# Altium schematic sheet MCU.SchDoc
size A; SheetNumber: 2; SheetTotal: 3
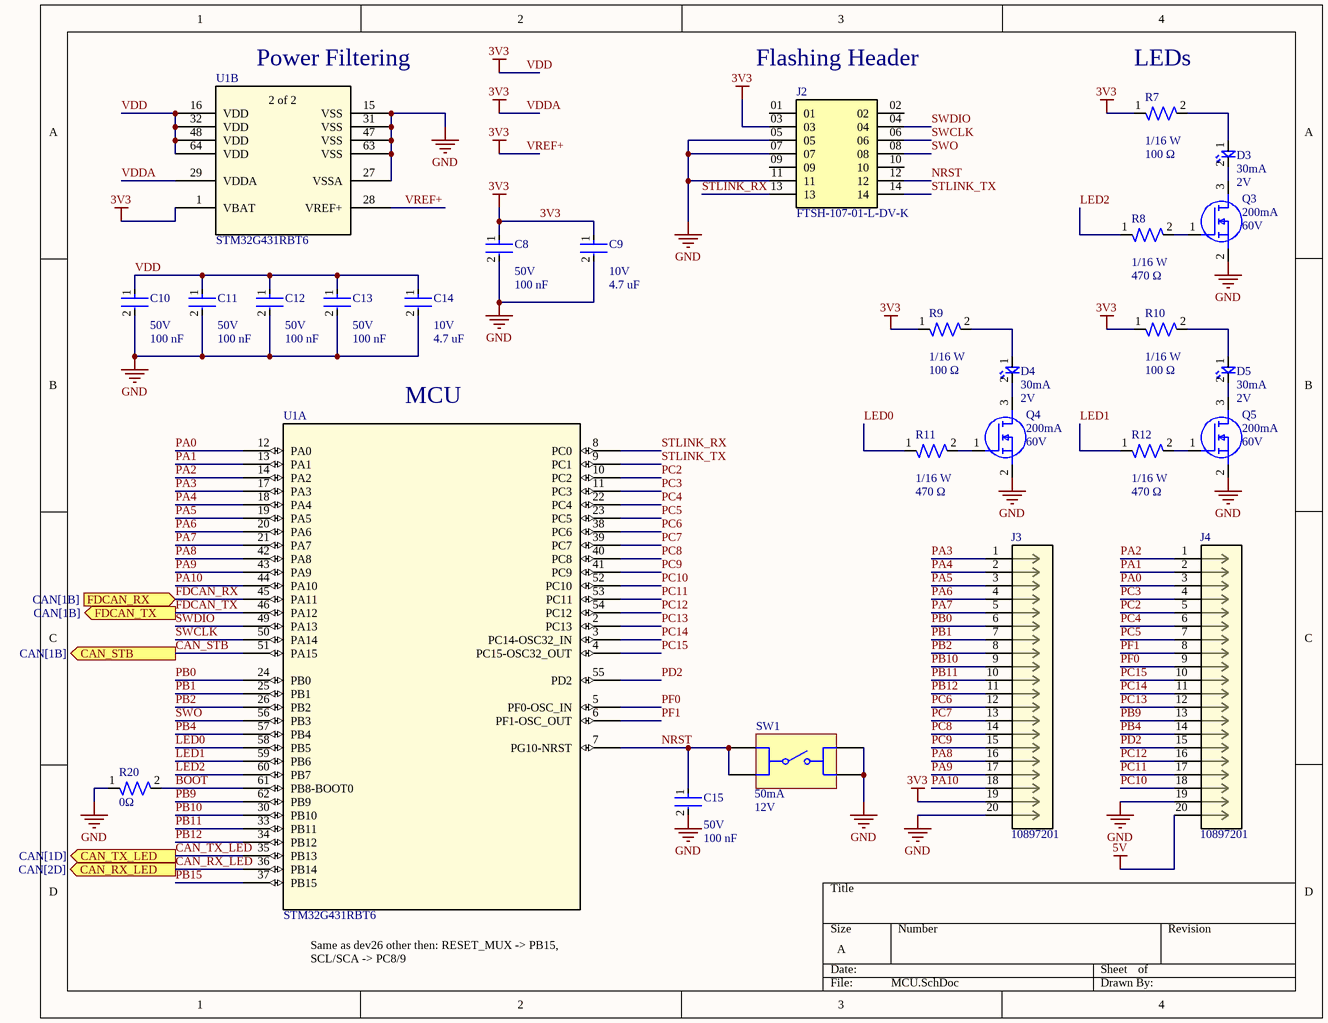
[diagram p0: MCU.SchDoc]

## Parts
C8  Voltage Rating: 50V  Capacitance: 100 nF  [CAP-0603]  (hidden comment: CC0603ZRY5V9BB104)
C9  Voltage Rating: 10V  Capacitance: 4.7 uF  [CAP-0402]  (hidden comment: GRM155R61A475MEAAD)
C10  Voltage Rating: 50V  Capacitance: 100 nF  [CAP-0603]  (hidden comment: CC0603ZRY5V9BB104)
C11  Voltage Rating: 50V  Capacitance: 100 nF  [CAP-0603]  (hidden comment: CC0603ZRY5V9BB104)
C12  Voltage Rating: 50V  Capacitance: 100 nF  [CAP-0603]  (hidden comment: CC0603ZRY5V9BB104)
C13  Voltage Rating: 50V  Capacitance: 100 nF  [CAP-0603]  (hidden comment: CC0603ZRY5V9BB104)
C14  Voltage Rating: 10V  Capacitance: 4.7 uF  [CAP-0402]  (hidden comment: GRM155R61A475MEAAD)
C15  Voltage Rating: 50V  Capacitance: 100 nF  [CAP-0603]  (hidden comment: CC0603ZRY5V9BB104)
D3  Forward Current: 30mA  Forward Voltage: 2V  [LED-0603]  (hidden comment: BL-HKC36G-AV-TRB)
D4  Forward Current: 30mA  Forward Voltage: 2V  [LED-0603]  (hidden comment: BL-HKC36G-AV-TRB)
D5  Forward Current: 30mA  Forward Voltage: 2V  [LED-0603]  (hidden comment: BL-HKC36G-AV-TRB)
J2  FTSH-107-01-L-DV-K  [SAMTEC_FTSH-107-01-L-DV-K]
J3  10897201  [CONN20_0010897201_MOL]
J4  10897201  [CONN20_0010897201_MOL]
Q3  Continuous Current: 200mA  Voltage: 60V  [IC-SOT23-3]  (hidden comment: T2N7002AK,LM)
Q4  Continuous Current: 200mA  Voltage: 60V  [IC-SOT23-3]  (hidden comment: T2N7002AK,LM)
Q5  Continuous Current: 200mA  Voltage: 60V  [IC-SOT23-3]  (hidden comment: T2N7002AK,LM)
R7  Wattage: 1/16 W  Resistance: 100 Ω  [RES-0402]  (hidden comment: RC0402FR-07100RL)
R8  Wattage: 1/16 W  Resistance: 470 Ω  [RES-0402]  (hidden comment: RC0402FR-07470RL)
R9  Wattage: 1/16 W  Resistance: 100 Ω  [RES-0402]  (hidden comment: RC0402FR-07100RL)
R10  Wattage: 1/16 W  Resistance: 100 Ω  [RES-0402]  (hidden comment: RC0402FR-07100RL)
R11  Wattage: 1/16 W  Resistance: 470 Ω  [RES-0402]  (hidden comment: RC0402FR-07470RL)
R12  Wattage: 1/16 W  Resistance: 470 Ω  [RES-0402]  (hidden comment: RC0402FR-07470RL)
R20  Resistance: 0Ω  [RES-2010]  (hidden comment: CRF2010-J/-000ELF)
SW1  Rated Current: 50mA  Rated Voltage (DC): 12V  [430182095816]  (hidden comment: 430182095816)
U1  STM32G431RBT6  [LQFP64-10x10mm]  (parts A,B of 2)

## Ports
CAN_RX_LED (out, see CAN[2D]), CAN_STB (out, see CAN[1B]), CAN_TX_LED (out, see CAN[1D]), FDCAN_RX (in, see CAN[1B]), FDCAN_TX (out, see CAN[1B])

## Nets
3V3: C8.1 C9.1 C10.1 C11.1 C12.1 C13.1 C14.1 J2.03 J3.19 R7.1 R9.1 R10.1 U1.1(VBAT) U1.16(VDD) U1.28(VREF+) U1.29(VDDA) U1.32(VDD) U1.48(VDD) U1.64(VDD)  [also labelled VDD, VDDA, VREF+]
5V: J4.20
GND: C8.2 C9.2 C10.2 C11.2 C12.2 C13.2 C14.2 C15.2 J2.05 J2.07 J2.11 J3.20 J4.19 Q3.2(S) Q4.2(S) Q5.2(S) R20.1 SW1.B1 SW1.B2 U1.15(VSS) U1.27(VSSA) U1.31(VSS) U1.47(VSS) U1.63(VSS)
BOOT: R20.2 U1.61(PB8-BOOT0)
CAN_RX_LED: U1.36(PB14) ; port CAN_RX_LED
CAN_STB: U1.51(PA15) ; port CAN_STB
CAN_TX_LED: U1.35(PB13) ; port CAN_TX_LED
FDCAN_RX: U1.45(PA11) ; port FDCAN_RX
FDCAN_TX: U1.46(PA12) ; port FDCAN_TX
LED0: R11.1 U1.58(PB5)
LED1: R12.1 U1.59(PB6)
LED2: R8.1 U1.60(PB7)
NRST: C15.1 J2.12 SW1.A1 SW1.A2 U1.7(PG10-NRST)
PA0: J4.3 U1.12(PA0)
PA1: J4.2 U1.13(PA1)
PA2: J4.1 U1.14(PA2)
PA3: J3.1 U1.17(PA3)
PA4: J3.2 U1.18(PA4)
PA5: J3.3 U1.19(PA5)
PA6: J3.4 U1.20(PA6)
PA7: J3.5 U1.21(PA7)
PA8: J3.16 U1.42(PA8)
PA9: J3.17 U1.43(PA9)
PA10: J3.18 U1.44(PA10)
PB0: J3.6 U1.24(PB0)
PB1: J3.7 U1.25(PB1)
PB2: J3.8 U1.26(PB2)
PB4: J4.14 U1.57(PB4)
PB9: J4.13 U1.62(PB9)
PB10: J3.9 U1.30(PB10)
PB11: J3.10 U1.33(PB11)
PB12: J3.11 U1.34(PB12)
PB15: U1.37(PB15)
PC2: J4.5 U1.10(PC2)
PC3: J4.4 U1.11(PC3)
PC4: J4.6 U1.22(PC4)
PC5: J4.7 U1.23(PC5)
PC6: J3.12 U1.38(PC6)
PC7: J3.13 U1.39(PC7)
PC8: J3.14 U1.40(PC8)
PC9: J3.15 U1.41(PC9)
PC10: J4.18 U1.52(PC10)
PC11: J4.17 U1.53(PC11)
PC12: J4.16 U1.54(PC12)
PC13: J4.12 U1.2(PC13)
PC14: J4.11 U1.3(PC14-OSC32_IN)
PC15: J4.10 U1.4(PC15-OSC32_OUT)
PD2: J4.15 U1.55(PD2)
PF0: J4.9 U1.5(PF0-OSC_IN)
PF1: J4.8 U1.6(PF1-OSC_OUT)
STLINK_RX: J2.13 U1.8(PC0)
STLINK_TX: J2.14 U1.9(PC1)
SWCLK: J2.06 U1.50(PA14)
SWDIO: J2.04 U1.49(PA13)
SWO: J2.08 U1.56(PB3)
NetD3_1: D3.1 R7.2
NetD3_2: D3.2 Q3.3(D)
NetD4_1: D4.1 R9.2
NetD4_2: D4.2 Q4.3(D)
NetD5_1: D5.1 R10.2
NetD5_2: D5.2 Q5.3(D)
NetQ3_1: Q3.1(G) R8.2
NetQ4_1: Q4.1(G) R11.2
NetQ5_1: Q5.1(G) R12.2

Not connected (* = marked no-connect by the designer): J2 01 02 09 10

## Notes on the sheet
- (near U1) Power Filtering
- (near J2) Flashing Header
- (near R7) LEDs
- (near U1) MCU
- Same as dev26 other then: RESET_MUX -> PB15, SCL/SCA -> PC8/9
- (in symbol IC-STM32G431RBT6, part B) 2 of 2

## Library data of the parts
C8 C10-C13 C15 = CAP 0603
C9 C14 = CAP 0402
D3-D5 = LED-0001: LED YELLOW CLEAR 0603 SMD; ComponentLink1Description: Datasheet; ComponentLink1URL: https://www.americanbrightled.com/pdffiles/led-components/smt/BL-HKC36G-AV-TRB.pdf
J2 = CONN_Flashing-0001: Connector Header Surface Mount 14 position 0.050" (1.27mm); MF: Samtec; Value: *; Price: None; Package: None; Availability: Unavailable; MP: FTSH-107-01-L-DV-K; ComponentLink1Description: Datasheet; ComponentLink1URL: https://mm.digikey.com/Volume0/opasdata/d220001/medias/docus/6209/ftsh-1xx-xx-xxx-dv-xxx-xxx-x-xx-mkt.pdf
J3 J4 = CONN-20: 2.54mm Pitch C-Grid Breakaway Header, Dual Row, Vertical, High Temperature, 20 Circuits, Tin (Sn) Plating, 2.72mm PC Tail Length; Manufacturer_Name: Molex Connector Corporation; Copyright: Copyright (C) 2025 Ultra Librarian. All rights reserved.; Manufacturer_Part_Number: 10897201; Datasheet: https://www.molex.com/en-us/products/part-detail-pdf/10897201?display=pdf; RefDes: RefDes; Type: Type
Q3-Q5 = NMOS-200MA-0001: MOSFET N-CH 60V 200MA SOT23; ComponentLink1Description: Datasheet; ComponentLink1URL: https://toshiba.semicon-storage.com/info/T2N7002AK_datasheet_en_20150401.pdf?did=29712&prodName=T2N7002AK
R7-R12 = RES 0402
R20 = RES-0-0001: 0 Ohms Jumper Chip Resistor 2010 (5025 Metric) Automotive AEC-Q200 Metal Element; Tolerance: 1%; Size: 0402; ComponentLink1Description: Datasheet; ComponentLink1URL: https://www.yageo.com/upload/media/product/products/datasheet/rchip/PYu-RC_Group_51_RoHS_L_12.pdf
SW1 = BUTTON-VERT-12V-0.5A: WS-TASV SMT Tact Switch, 6mm x 6mm, 160gf, SPST-NO, 12V, 50mA; Manufacturer: Wurth Elektronik; Washable: No; Manufacturer Part Number: 430182095816; Category: Tact Switch; Match Code: WS-TASV; ComponentLink1Description: Website Link; ComponentLink1URL: https://www.we-online.com/redexpert/article/430182095816?ad; ComponentLink2Description: Datasheet Link; ComponentLink2URL: https://www.we-online.com/redexpert/spec/430182095816?ad; Mount: Surface Mount; Min Operating Temperature: -40°C; Max Operating Temperature: 85°C; Packaging: Tape and Reel; Length: 6mm; Width: 6mm; Height: 9.5mm; Circuit: SPST-NO; Contact Material: Stainless Steel; Contact Plating: Silver; Operation Force: 160gf; Terminal Material: Copper Alloy; Terminal Plating: Silver
U1 = IC-STM32G431RBT6: Mainstream Arm Cortex-M4 MCU 170 MHz with 128 Kbytes of Flash memory, Math Accelerator, Medium Analog level integration; Manufacturer_Name: STMicroelectronics; Copyright: Copyright (C) 2025 Ultra Librarian. All rights reserved.; Manufacturer_Part_Number: STM32G431RBT6; Datasheet: https://www.st.com/resource/en/datasheet/stm32g431c6.pdf; RefDes: RefDes; Type: Type